# Altium schematic sheet CF_DAC.SchDoc
size Tabloid; DocumentNumber: 4; SheetNumber: 4; SheetTotal: 10; Sheet_Name: CF_DAC; Size: 11x17
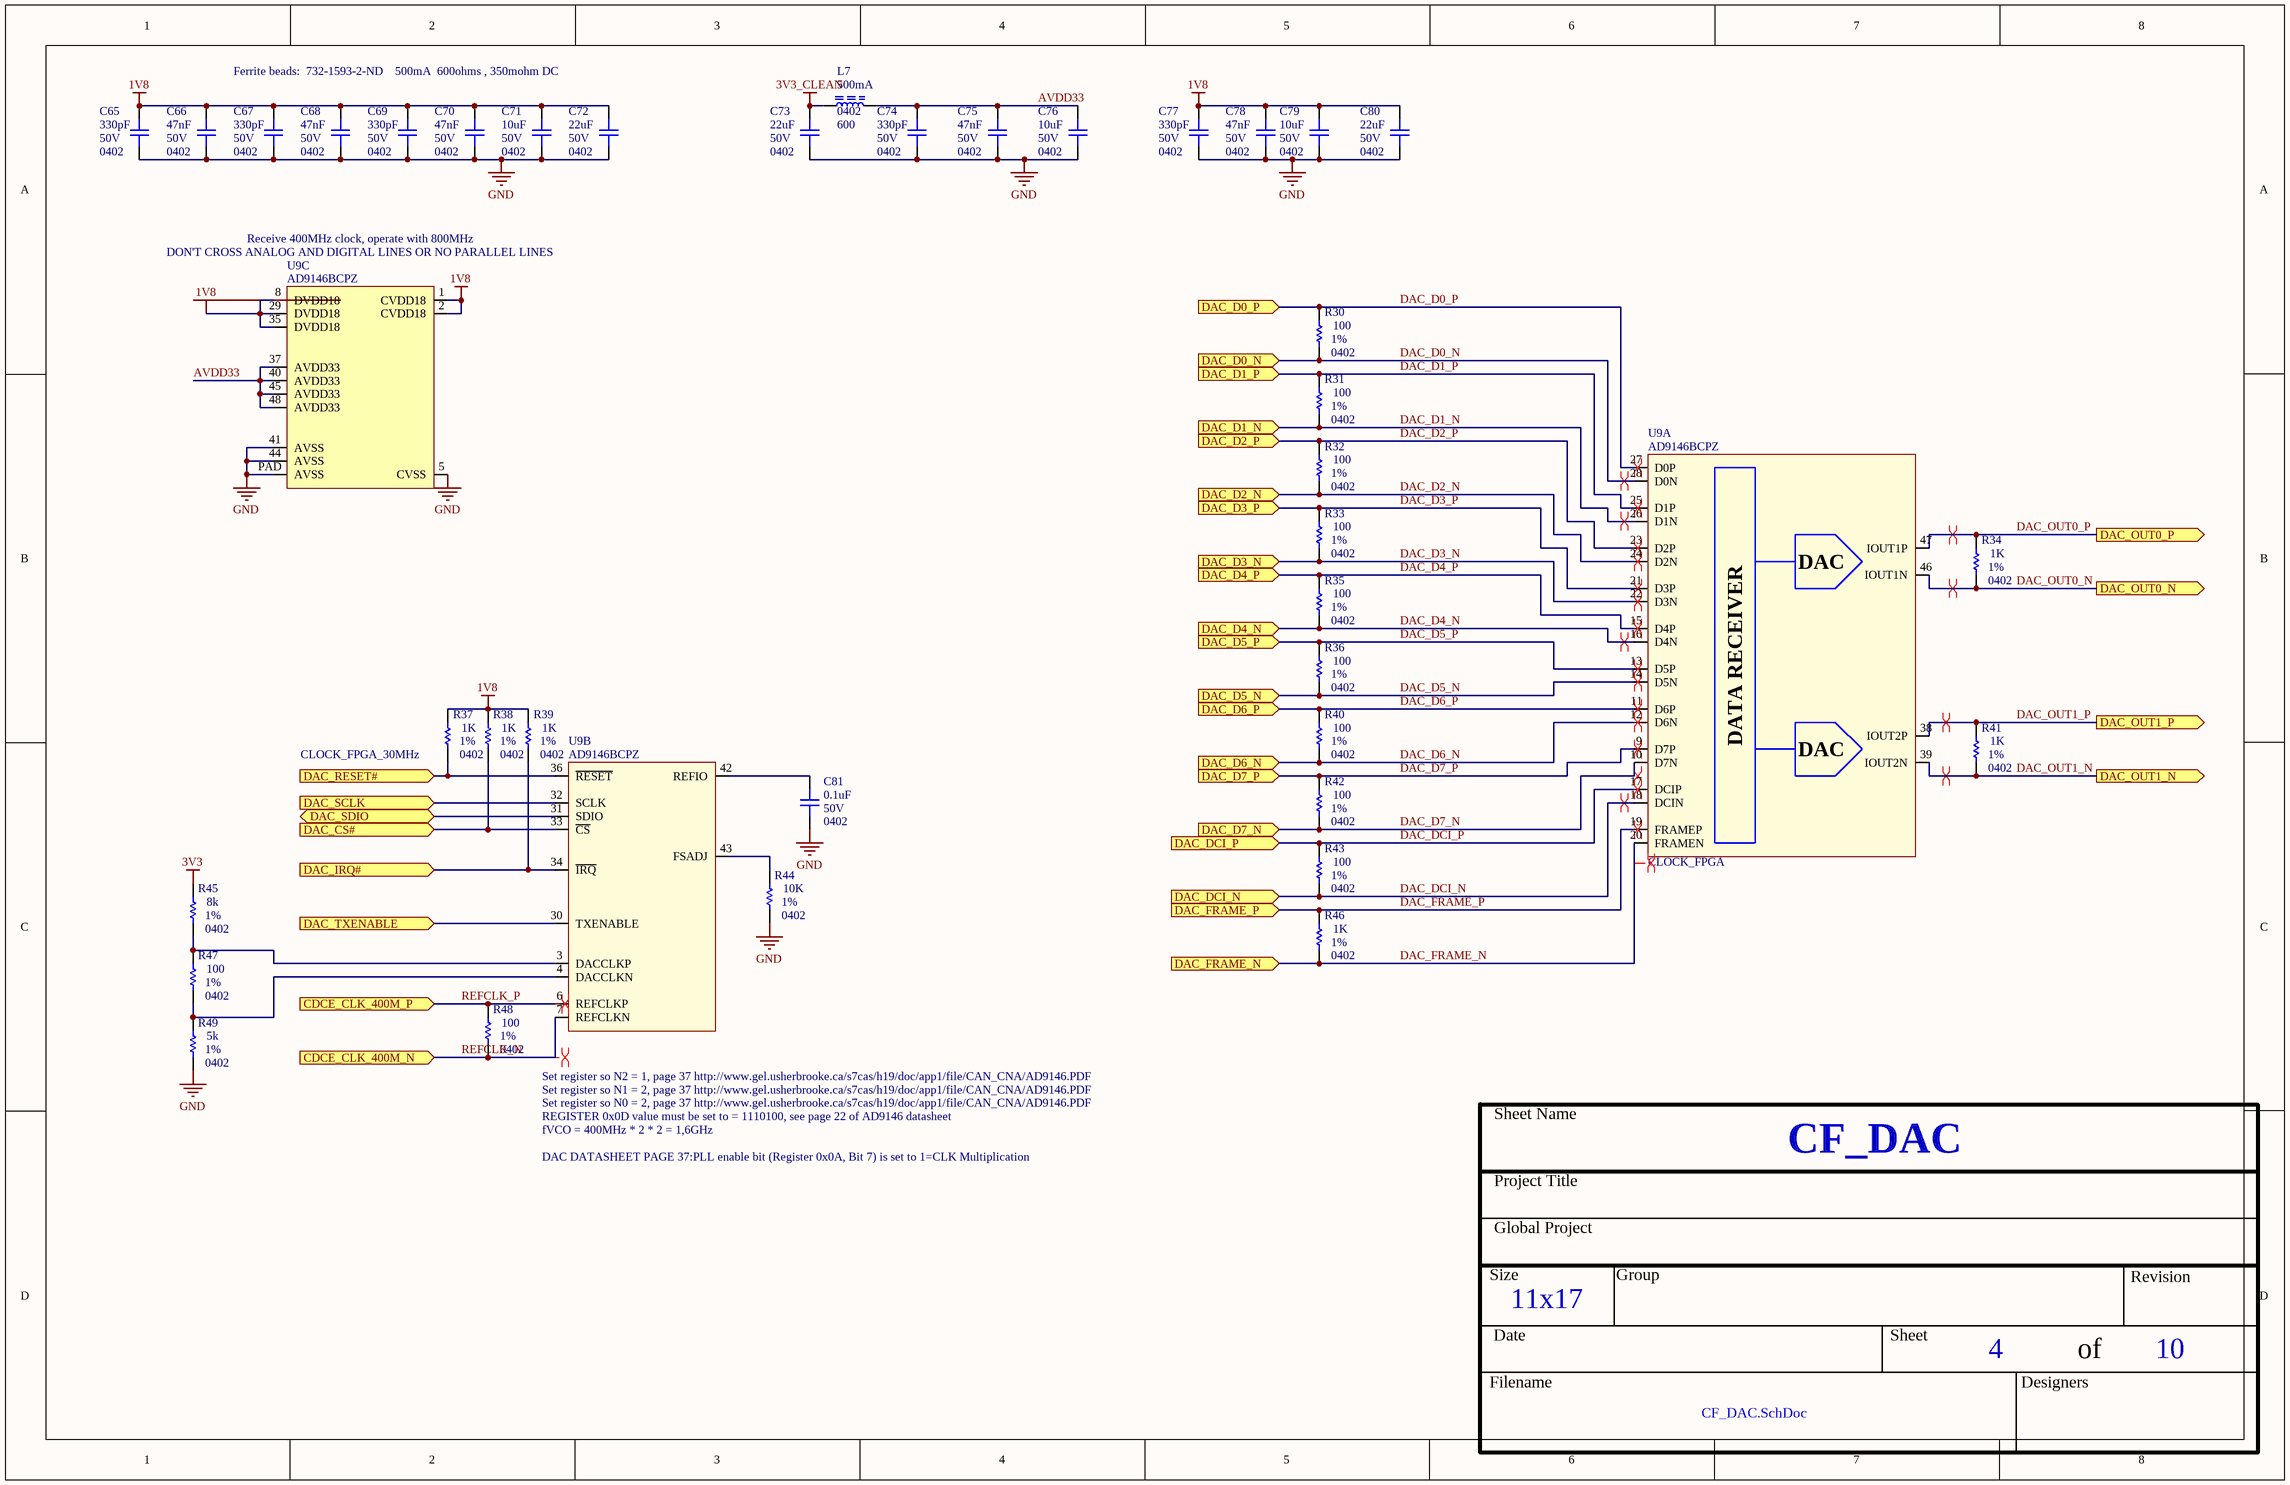
[diagram p0: CF_DAC.SchDoc]

## Parts
C65  value 330pF  Voltage: 50V  Package: 0402  [CAP_0402]  (hidden comment: CAP - 0402)
C66  value 47nF  Voltage: 50V  Package: 0402  [CAP_0402]  (hidden comment: CAP - 0402)
C67  value 330pF  Voltage: 50V  Package: 0402  [CAP_0402]  (hidden comment: CAP - 0402)
C68  value 47nF  Voltage: 50V  Package: 0402  [CAP_0402]  (hidden comment: CAP - 0402)
C69  value 330pF  Voltage: 50V  Package: 0402  [CAP_0402]  (hidden comment: CAP - 0402)
C70  value 47nF  Voltage: 50V  Package: 0402  [CAP_0402]  (hidden comment: CAP - 0402)
C71  value 10uF  Voltage: 50V  Package: 0402  [CAP_0402]  (hidden comment: CAP - 0402)
C72  value 22uF  Voltage: 50V  Package: 0402  [CAP_0402]  (hidden comment: CAP - 0402)
C73  value 22uF  Voltage: 50V  Package: 0402  [CAP_0402]  (hidden comment: CAP - 0402)
C74  value 330pF  Voltage: 50V  Package: 0402  [CAP_0402]  (hidden comment: CAP - 0402)
C75  value 47nF  Voltage: 50V  Package: 0402  [CAP_0402]  (hidden comment: CAP - 0402)
C76  value 10uF  Voltage: 50V  Package: 0402  [CAP_0402]  (hidden comment: CAP - 0402)
C77  value 330pF  Voltage: 50V  Package: 0402  [CAP_0402]  (hidden comment: CAP - 0402)
C78  value 47nF  Voltage: 50V  Package: 0402  [CAP_0402]  (hidden comment: CAP - 0402)
C79  value 10uF  Voltage: 50V  Package: 0402  [CAP_0402]  (hidden comment: CAP - 0402)
C80  value 22uF  Voltage: 50V  Package: 0402  [CAP_0402]  (hidden comment: CAP - 0402)
C81  value 0.1uF  Voltage: 50V  Package: 0402  [CAP_0402]  (hidden comment: CAP - 0402)
L7  value 600  Current: 500mA  Package: 0402  [FER_0402]  (hidden comment: FER - 0402)
R30  value 100  Package: 0402  Precision: 1%  [RES_0402]  (hidden comment: RES - 0402)
R31  value 100  Package: 0402  Precision: 1%  [RES_0402]  (hidden comment: RES - 0402)
R32  value 100  Package: 0402  Precision: 1%  [RES_0402]  (hidden comment: RES - 0402)
R33  value 100  Package: 0402  Precision: 1%  [RES_0402]  (hidden comment: RES - 0402)
R34  value 1K  Package: 0402  Precision: 1%  [RES_0402]  (hidden comment: RES - 0402)
R35  value 100  Package: 0402  Precision: 1%  [RES_0402]  (hidden comment: RES - 0402)
R36  value 100  Package: 0402  Precision: 1%  [RES_0402]  (hidden comment: RES - 0402)
R37  value 1K  Package: 0402  Precision: 1%  [RES_0402]  (hidden comment: RES - 0402)
R38  value 1K  Package: 0402  Precision: 1%  [RES_0402]  (hidden comment: RES - 0402)
R39  value 1K  Package: 0402  Precision: 1%  [RES_0402]  (hidden comment: RES - 0402)
R40  value 100  Package: 0402  Precision: 1%  [RES_0402]  (hidden comment: RES - 0402)
R41  value 1K  Package: 0402  Precision: 1%  [RES_0402]  (hidden comment: RES - 0402)
R42  value 100  Package: 0402  Precision: 1%  [RES_0402]  (hidden comment: RES - 0402)
R43  value 100  Package: 0402  Precision: 1%  [RES_0402]  (hidden comment: RES - 0402)
R44  value 10K  Package: 0402  Precision: 1%  [RES_0402]  (hidden comment: RES - 0402)
R45  value 8k  Package: 0402  Precision: 1%  [RES_0402]  (hidden comment: RES - 0402)
R46  value 1K  Package: 0402  Precision: 1%  [RES_0402]  (hidden comment: RES - 0402)
R47  value 100  Package: 0402  Precision: 1%  [RES_0402]  (hidden comment: RES - 0402)
R48  value 100  Package: 0402  Precision: 1%  [RES_0402]  (hidden comment: RES - 0402)
R49  value 5k  Package: 0402  Precision: 1%  [RES_0402]  (hidden comment: RES - 0402)
U9  AD9146BCPZ  [DAC_AD9146BCPZ]  (parts A,B,C of 3)

## Ports
CDCE_CLK_400M_N (in), CDCE_CLK_400M_P (in), DAC_CS# (in), DAC_D0_N (in), DAC_D0_P (in), DAC_D1_N (in), DAC_D1_P (in), DAC_D2_N (in), DAC_D2_P (in), DAC_D3_N (in), DAC_D3_P (in), DAC_D4_N (in), DAC_D4_P (in), DAC_D5_N (in), DAC_D5_P (in), DAC_D6_N (in), DAC_D6_P (in), DAC_D7_N (in), DAC_D7_P (in), DAC_DCI_N (in), DAC_DCI_P (in), DAC_FRAME_N (in), DAC_FRAME_P (in), DAC_IRQ# (in), DAC_OUT0_N (out), DAC_OUT0_P (out), DAC_OUT1_N (out), DAC_OUT1_P (out), DAC_RESET# (in), DAC_SCLK (in), DAC_SDIO (bidir), DAC_TXENABLE (in)

## Nets
1V8: C65.2 C66.2 C67.2 C68.2 C69.2 C70.2 C71.2 C72.2 C77.2 C78.2 C79.2 C80.2 R37.2 R38.2 R39.2 U9.1(CVDD18) U9.2(CVDD18) U9.8(DVDD18) U9.29(DVDD18) U9.35(DVDD18)
3V3: R45.2
3V3_CLEAN: C73.2 L7.2
GND: C65.1 C66.1 C67.1 C68.1 C69.1 C70.1 C71.1 C72.1 C73.1 C74.1 C75.1 C76.1 C77.1 C78.1 C79.1 C80.1 C81.1 R44.1 R49.1 U9.5(CVSS) U9.41(AVSS) U9.44(AVSS) U9.PAD(AVSS)
AVDD33: C74.2 C75.2 C76.2 L7.1 U9.37(AVDD33) U9.40(AVDD33) U9.45(AVDD33) U9.48(AVDD33)
DAC_CS#: R38.1 U9.33(~{CS}) ; port DAC_CS#
DAC_D0_N: R30.1 U9.28(D0N) ; port DAC_D0_N
DAC_D0_P: R30.2 U9.27(D0P) ; port DAC_D0_P
DAC_D1_N: R31.1 U9.26(D1N) ; port DAC_D1_N
DAC_D1_P: R31.2 U9.25(D1P) ; port DAC_D1_P
DAC_D2_N: R32.1 U9.24(D2N) ; port DAC_D2_N
DAC_D2_P: R32.2 U9.23(D2P) ; port DAC_D2_P
DAC_D3_N: R33.1 U9.22(D3N) ; port DAC_D3_N
DAC_D3_P: R33.2 U9.21(D3P) ; port DAC_D3_P
DAC_D4_N: R35.1 U9.16(D4N) ; port DAC_D4_N
DAC_D4_P: R35.2 U9.15(D4P) ; port DAC_D4_P
DAC_D5_N: R36.1 U9.14(D5N) ; port DAC_D5_N
DAC_D5_P: R36.2 U9.13(D5P) ; port DAC_D5_P
DAC_D6_N: R40.1 U9.12(D6N) ; port DAC_D6_N
DAC_D6_P: R40.2 U9.11(D6P) ; port DAC_D6_P
DAC_D7_N: R42.1 U9.10(D7N) ; port DAC_D7_N
DAC_D7_P: R42.2 U9.9(D7P) ; port DAC_D7_P
DAC_DCI_N: R43.1 U9.18(DCIN) ; port DAC_DCI_N
DAC_DCI_P: R43.2 U9.17(DCIP) ; port DAC_DCI_P
DAC_FRAME_N: R46.1 U9.20(FRAMEN) ; port DAC_FRAME_N
DAC_FRAME_P: R46.2 U9.19(FRAMEP) ; port DAC_FRAME_P
DAC_IRQ#: R39.1 U9.34(~{IRQ}) ; port DAC_IRQ#
DAC_OUT0_N: R34.1 U9.46(IOUT1N) ; port DAC_OUT0_N
DAC_OUT0_P: R34.2 U9.47(IOUT1P) ; port DAC_OUT0_P
DAC_OUT1_N: R41.1 U9.39(IOUT2N) ; port DAC_OUT1_N
DAC_OUT1_P: R41.2 U9.38(IOUT2P) ; port DAC_OUT1_P
DAC_RESET#: R37.1 U9.36(~{RESET}) ; port DAC_RESET#
DAC_SCLK: U9.32(SCLK) ; port DAC_SCLK
DAC_SDIO: U9.31(SDIO) ; port DAC_SDIO
DAC_TXENABLE: U9.30(TXENABLE) ; port DAC_TXENABLE
REFCLK_N: R48.1 U9.7(REFCLKN) ; port CDCE_CLK_400M_N
REFCLK_P: R48.2 U9.6(REFCLKP) ; port CDCE_CLK_400M_P
NetC81_2: C81.2 U9.42(REFIO)
NetR44_2: R44.2 U9.43(FSADJ)
NetR45_1: R45.1 R47.2 U9.3(DACCLKP)
NetR47_1: R47.1 R49.2 U9.4(DACCLKN)

## Layout directives
differential pair: DAC_D0_N, DAC_D0_P, DAC_D1_N, DAC_D1_P, DAC_D2_N, DAC_D2_P, DAC_D3_N, DAC_D3_P, DAC_D4_N, DAC_D4_P, DAC_D5_N, DAC_D5_P, DAC_D6_N, DAC_D6_P, DAC_D7_N, DAC_D7_P, DAC_DCI_N, DAC_DCI_P, DAC_FRAME_N, DAC_FRAME_P, DAC_OUT0_N, DAC_OUT0_P, DAC_OUT1_N, DAC_OUT1_P, REFCLK_N, REFCLK_P

## Notes on the sheet
- Ferrite beads:  732-1593-2-ND    500mA  600ohms , 350mohm DC
- (near U9) DON'T CROSS ANALOG AND DIGITAL LINES OR NO PARALLEL LINES
- Receive 400MHz clock, operate with 800MHz
- (near R37) CLOCK_FPGA_30MHz
- (near U9) CLOCK_FPGA
- Set register so N1 = 2, page 37 http://www.gel.usherbrooke.ca/s7cas/h19/doc/app1/file/CAN_CNA/AD9146.PDF
- Set register so N2 = 1, page 37 http://www.gel.usherbrooke.ca/s7cas/h19/doc/app1/file/CAN_CNA/AD9146.PDF
- Set register so N0 = 2, page 37 http://www.gel.usherbrooke.ca/s7cas/h19/doc/app1/file/CAN_CNA/AD9146.PDF
- DAC DATASHEET PAGE 37:PLL enable bit (Register 0x0A, Bit 7) is set to 1=CLK Multiplication
- fVCO = 400MHz * 2 * 2 = 1,6GHz
- REGISTER 0x0D value must be set to = 1110100, see page 22 of AD9146 datasheet
- Sheet Name
- Project Title
- Global Project
- Size
- Group
- Revision
- Date
- Sheet
- of
- Filename
- Designers
- (in symbol DAC_AD9146BCPZ, part A) DAC; DATA RECEIVER

## Library data of the parts
C65-C81 = CAP - 0402: Precision: 10%; Current: *; CreatedBy: Jonathan Bouchard; Power: *
R30-R49 = RES - 0402: Voltage: 50V; Power: 1/16W; Current: *; CreatedBy: Jonathan Bouchard
U9 = DAC_AD9146BCPZ: DAC - 16BIT SRL HIGH SPEED - QFN-48; Voltage: 3.13 V ~ 3.47 V / 1.71 V ~ 1.89 V; Mfg: Analog Devices Inc.; Current: *; Power: *; Mfg Part Number: AD9146BCPZ; HelpURL: http://www.analog.com/media/en/technical-documentation/data-sheets/AD9146.PDF; CreatedBy: Jonathan Bouchard; Temperature: -40°C ~ 85°C; Value: *; Precision: 16 Bit; Package: QFN-48; Supplier 1: Digikey; Supplier Part Number 1: AD9146BCPZ-ND
L7 = FER - 0402: Voltage: *; CreatedBy: Jonathan Bouchard; Power: *; Precision: *